# Altium schematic sheet [02] - DCDC_+5V7.SchDoc
size 297 x 209 mm; CompanyName: Wave; SheetNumber: 4; SheetTotal: 5; PRJ_SheetSize: A4
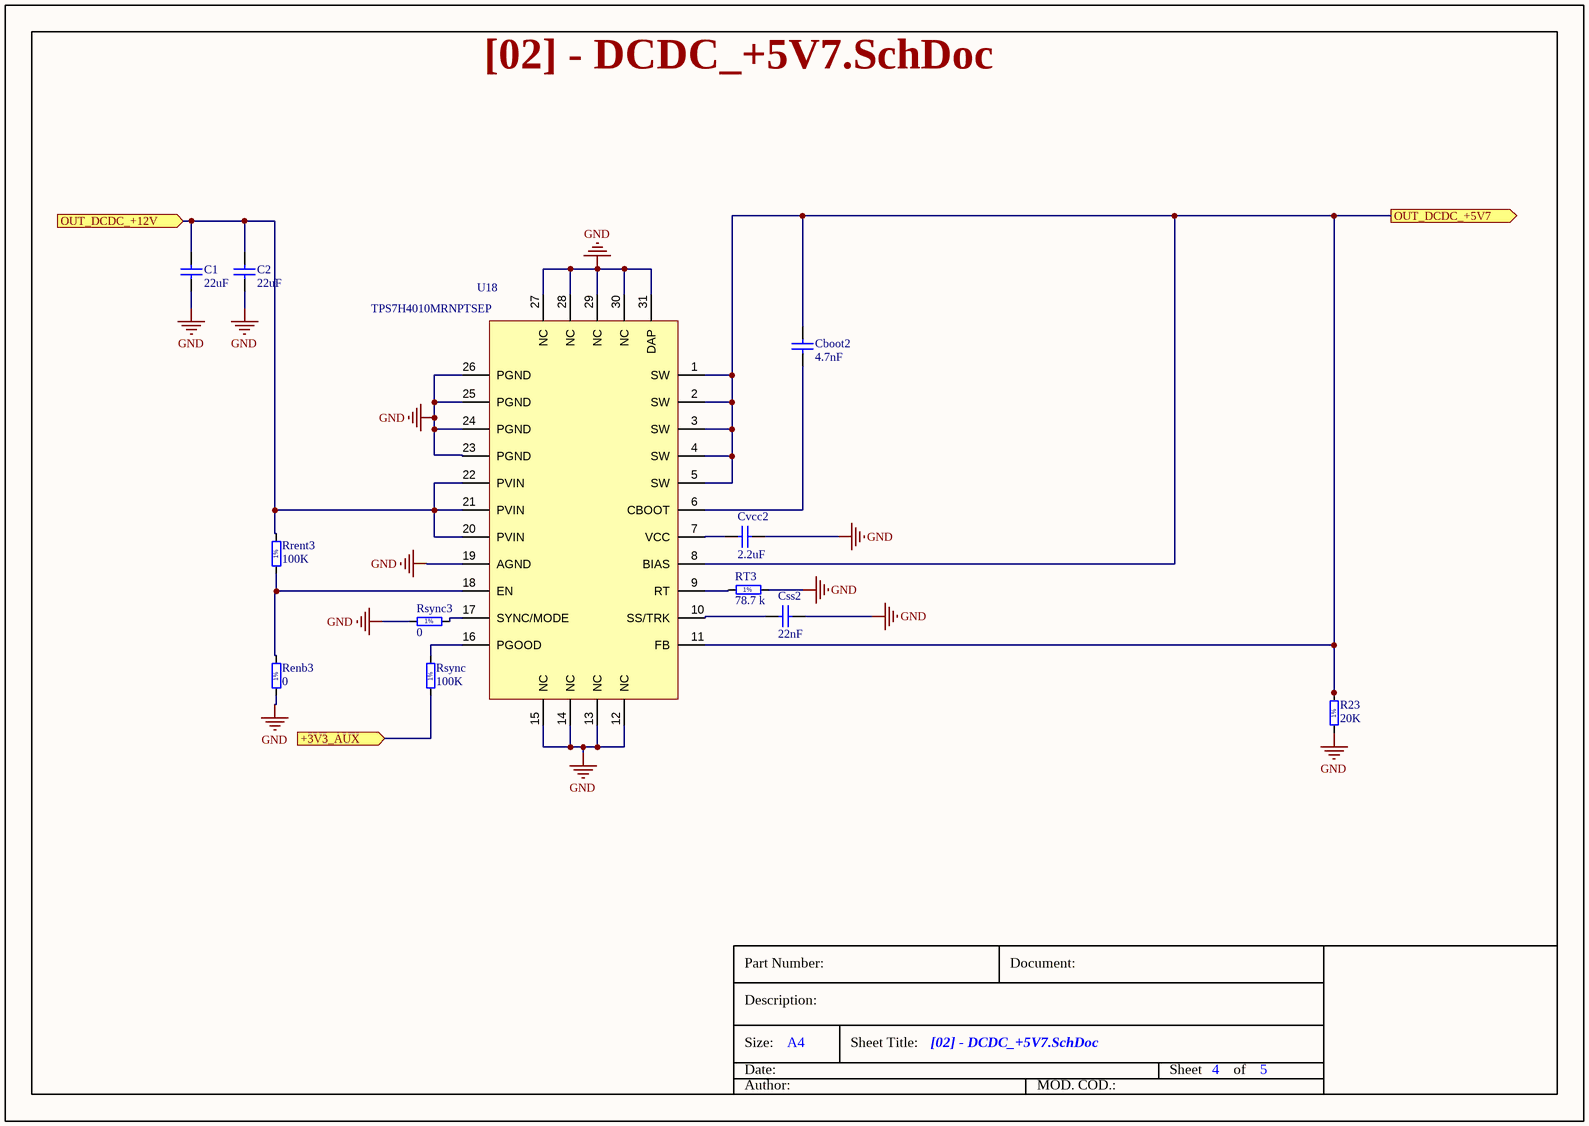
[diagram p0: [02] - DCDC_+5V7.SchDoc]

## Parts
C1  22uF  [CAPC320X160X180L55N]
C2  22uF  [CAPC320X160X180L55N]
Cboot2  4.7nF  [CAPC100X55X55L35N]
Css2  22nF  [CAPC100X55X55L35N]
Cvcc2  2.2uF  [CAPC100X55X55L35N]
R23  20K  [RESC100X50X40L25N]
Renb3  0  [RESC100X50X40L25N]
Rrent3  100K  [RESC100X50X40L25N]
Rsync  100K  [RESC100X50X40L25N]
Rsync3  0  [RESC100X50X40L25N]
RT3  78.7 k  [RESC100X50X40L25N]
U18  TPS7H4010MRNPTSEP  [TPS7H4010MRNPTSEP]

## Ports
+3V3_AUX (in, see [01] - PCU_MODULE[2B], [03] - OUT_+5V7_OCXO_PROTECTION[1C]), OUT_DCDC_+5V7 (out, see [01] - PCU_MODULE[2A], [04] - PSU_+5V_AUX[1A]), OUT_DCDC_+12V (in, see [01] - PCU_MODULE[2A])

## Nets
GND: C1.1 C2.1 Css2.2 Cvcc2.2 R23.1 Renb3.1 Rsync3.1 RT3.2 U18.12(NC) U18.13(NC) U18.14(NC) U18.15(NC) U18.19(AGND) U18.23(PGND) U18.24(PGND) U18.25(PGND) U18.26(PGND) U18.27(NC) U18.28(NC) U18.29(NC) U18.30(NC) U18.31(DAP)
+3V3_AUX: Rsync.1 ; port +3V3_AUX
OUT_DCDC_+5V7: Cboot2.2 R23.2 U18.1(SW) U18.2(SW) U18.3(SW) U18.4(SW) U18.5(SW) U18.8(BIAS) U18.11(FB) ; port OUT_DCDC_+5V7
OUT_DCDC_+12V: C1.2 C2.2 Rrent3.2 U18.20(PVIN) U18.21(PVIN) U18.22(PVIN) ; port OUT_DCDC_+12V
NetCboot2_1: Cboot2.1 U18.6(CBOOT)
NetCss2_1: Css2.1 U18.10(SS/TRK)
NetCvcc2_1: Cvcc2.1 U18.7(VCC)
NetRenb3_2: Renb3.2 Rrent3.1 U18.18(EN)
NetRsync3_2: Rsync3.2 U18.17(SYNC/MODE)
NetRsync_2: Rsync.2 U18.16(PGOOD)
NetRT3_1: RT3.1 U18.9(RT)

## Notes on the sheet
- Part Number:
- Description:
- Document:
- Date:
- Size:
- Sheet Title:
- Sheet
- of
- Author:
- MOD. COD.:
- (in symbol CRCW040220K0FKED) 1%
- (in symbol CRCW040278K7FKED) 1%
- (in symbol CRCW0402100KFKED) 1%

## Library data of the parts
C1 C2 = GRM31CC71E226ME15L: CAP CER 22uF 25V ±20% X7S 1206; Manufacturer: Murata; Material: 4241ConductorMaterial; Dielectric: 1542DielectricType; ComponentLink1URL: https://search.murata.co.jp/Ceramy/image/img/A01X/G101/ENG/GRM31CC71E226ME15-01A.pdf; ComponentLink1Description: Datasheet; Supplier: Digikey; Manufacturer Part Number: GRM31CC71E226ME15L; RoHS: No; Category: Ceramic Capacitors; Stock 1: 3447; Pricing 1: 1=0,92, 10=0,562, 50=0,4202, 100=0,3759, 500=0,30056, 1000=0,27702 (USD); Case/Package: 340Case; Min Operating Temperature: -55°C; Max Operating Temperature: 125°C; Capacitance: 22uF; Tolerance: 20%; Voltage Rating: 25V; Voltage Rating (DC): 25V; Length: 3.2mm; Width: 1.6mm; Height: 1.9mm; Thickness: 1.6mm; Supplier Part Number: 490-GRM31CC71E226ME15LCT-ND
Cboot2 = GRM155R71E472KA01: 0402 4.7 nF 25 V ±10% Tolerance X7R SMT Multilayer Ceramic Capacitor; Manufacturer: Murata; Manufacturer Part Number: GRM155R71E472KA01D; Supplier: Farnell; Supplier Part Number: 4326802; RoHS: Yes; Category: Ceramic Capacitors; Stock: 39799; Pricing: 10=0,015, 100=0,01, 500=0,007, 2500=0,006, 5000=0,0059 (EUR); Pins: 2NUMBER; Material: 4241ConductorMaterial; Lead Free: 5697LeadFree; ComponentLink1URL: https://datasheet.ciiva.com/18184/getdatasheetpartid-129543-18184709.pdf?src-supplier=Verical; ComponentLink1Description: https://datasheet.ciiva.com/18184/getdatasheetpartid-129543-18184709.pdf?src-supplier=Verical; ComponentLink2URL: https://datasheet.ciiva.com/130/product-130032.pdf?src-supplier=Digikey; ComponentLink2Description: https://datasheet.ciiva.com/130/product-130032.pdf?src-supplier=Digikey; ComponentLink3URL: https://datasheet.ciiva.com/16392/product-16392847.pdf?src-supplier=Future+Electronics; ComponentLink3Description: https://datasheet.ciiva.com/16392/product-16392847.pdf?src-supplier=Future+Electronics; ComponentLink4URL: https://datasheet.ciiva.com/2989/product-2989394.pdf?src-supplier=Avnet; ComponentLink4Description: https://datasheet.ciiva.com/2989/product-2989394.pdf?src-supplier=Avnet; ComponentLink5URL: https://datasheet.ciiva.com/2989/product-2989393.pdf?src-supplier=Avnet; ComponentLink5Description: https://datasheet.ciiva.com/2989/product-2989393.pdf?src-supplier=Avnet; ComponentLink6URL: https://datasheet.ciiva.com/130/partnumbering-e-01-130033.pdf?src-supplier=Digikey; ComponentLink6Description: https://datasheet.ciiva.com/130/partnumbering-e-01-130033.pdf?src-supplier=Digikey; ComponentLink7URL: https://datasheet.ciiva.com/130/partnumbering-e-01-130034.pdf?src-supplier=Digikey; ComponentLink7Description: https://datasheet.ciiva.com/130/partnumbering-e-01-130034.pdf?src-supplier=Digikey
Css2 = GRM155R71E223JA61: Multilayer Ceramic Capacitor, 0.022 uF, 25 V, ± 5%, X7R, 0402 [1005 Metric]; Manufacturer: Murata; Manufacturer Part Number: GRM155R71E223JA61D; Supplier: Farnell; Supplier Part Number: 3582812; RoHS: Yes; Category: Ceramic Capacitors; Stock: 11149; Pricing: 10=0,017, 100=0,013, 500=0,012, 2500=0,0118, 5000=0,0115 (EUR); Material: 4241ConductorMaterial; ComponentLink1URL: https://datasheet.ciiva.com/5427/product-5427580.pdf?src-supplier=Mouser; ComponentLink1Description: https://datasheet.ciiva.com/5427/product-5427580.pdf?src-supplier=Mouser; ComponentLink2URL: https://datasheet.ciiva.com/29535/grm155r71e223ka61-01-29535418.pdf?src-supplier=Digikey; ComponentLink2Description: https://datasheet.ciiva.com/29535/grm155r71e223ka61-01-29535418.pdf?src-supplier=Digikey
Cvcc2 = GRM155D71C225ME11: Multilayer Ceramic Capacitor, 2.2 uF, 16 V, ± 20%, X7T, 0402 [1005 Metric]; Manufacturer: Murata; Manufacturer Part Number: GRM155D71C225ME11D; Dielectric: 1545DielectricType; Voltage Rating: 16V; Supplier: Mouser; Supplier Part Number: 81-GRM155D71C225ME11; RoHS: Yes; Category: Ceramic Capacitors; Stock: 102807; Pricing: 1=0,17, 10=0,113, 50=0,113, 100=0,073, 1000=0,067, 10000=0,057 (USD); Case/Package: 343Case; Material: 4241ConductorMaterial; Min Operating Temperature: -55°C; Max Operating Temperature: 125°C; Value: 2.2uF; Tolerance: 20%; Voltage Rating (DC): 16V; Length: 1mm; Width: 500um; Height: 650um; Thickness: 500um; RoHS Compliant: Yes; ComponentLink1URL: https://datasheet.octopart.com/GRM155D71C225ME11D-Murata-datasheet-165579666.pdf?src-supplier=TME; ComponentLink1Description: https://datasheet.octopart.com/GRM155D71C225ME11D-Murata-datasheet-165579666.pdf?src-supplier=TME
R23 = CRCW040220K0FKED: RES 20K OHM 1/16W 1% 0402; Manufacturer: Vishay Dale; Power (Watts): 0,063 W, 1/16 W; Temperature Coefficient: ±100 ppm/ °C; Category: Resistors; Resistance: 20K; Tolerance: ±1%; Footprint Name: RESC1005X40N; ComponentLink1URL: http://www.vishay.com/docs/20035/dcrcwe3.pdf; ComponentLink1Description: Datasheet; Packaging: Cut Tape (CT); Supplier Part Number 1: 541-20.0KLCT-ND; Supplier 1: Digi-Key; Features: AEC Q100 automotive; Operating Temperature: -55 °C ~ 155 °C; Package / Case: 0402 (1005 metrico); Manufacturer Part Number: CRCW040220K0FKED; Part Status: Active; Composition: Thick Film; Manufacturer 1: Vishay Dale; Manufacturer Part Number 1: CRCW040220K0FKED
Renb3 Rsync Rsync3 = CRCW0402100KFKED: RES  100K OHM 1/16W 1% 0402; Manufacturer: Vishay Dale; Power (Watts): 0,063 W, 1/16 W; Temperature Coefficient: ±100 ppm/ °C; Category: Resistors; Resistance: 100K; Tolerance: ±1%; Footprint Name: RESC1005X40N; ComponentLink1URL: http://www.vishay.com/docs/20035/dcrcwe3.pdf; ComponentLink1Description: Datasheet; Packaging: Cut Tape (CT); Supplier Part Number 1: 541-100KLCT-ND; Supplier 1: Digi-Key; Features: AEC Q100 automotive; Operating Temperature: -55 °C ~ 155 °C; Package / Case: 0402 (1005 metrico); Manufacturer Part Number: CRCW0402100KFKED; Part Status: Active; Composition: Thick Film; Manufacturer 1: Vishay Dale; Manufacturer Part Number 1: CRCW0402100KFKED
Rrent3 = CRCW0402100KFKED: RES 100K OHM 1/16W 1% 0402; Manufacturer: Vishay Dale; Power (Watts): 0,063 W, 1/16 W; Temperature Coefficient: ±100 ppm/ °C; Category: Resistors; Resistance: 100K; Tolerance: ±1%; Footprint Name: RESC1005X40N; ComponentLink1URL: http://www.vishay.com/docs/20035/dcrcwe3.pdf; ComponentLink1Description: Datasheet; Packaging: Cut Tape (CT); Supplier Part Number 1: 541-100KLCT-ND; Supplier 1: Digi-Key; Features: AEC Q100 automotive; Operating Temperature: -55 °C ~ 155 °C; Package / Case: 0402 (1005 metrico); Manufacturer Part Number: CRCW0402100KFKED; Part Status: Active; Composition: Thick Film; Manufacturer 1: Vishay Dale; Manufacturer Part Number 1: CRCW0402100KFKED
RT3 = CRCW040278K7FKED: RES 78K7 OHM 1/16W 1% 0402; Manufacturer: Vishay Dale; Power (Watts): 0,063 W, 1/16 W; Temperature Coefficient: ±100 ppm/ °C; Category: Resistors; Resistance: 78K7; Tolerance: ±1%; Footprint Name: RESC1005X40N; ComponentLink1URL: http://www.vishay.com/docs/20035/dcrcwe3.pdf; ComponentLink1Description: Datasheet; Packaging: Cut Tape (CT); Supplier Part Number 1: 541-78.7KLCT-ND; Supplier 1: DigiKey; Features: AEC Q100 automotive; Operating Temperature: -55 °C ~ 155 °C; Package / Case: 0402 (1005 metrico); Manufacturer Part Number: CRCW040278K7FKED; Part Status: Active; Composition: Thick Film; Manufacturer 1: Vishay Dale; Manufacturer Part Number 1: CRCW040278K7FKED
U18 = TPS7H4010MRNPTSEP: Buck Switching Regulator IC Positive Adjustable 1V 1 Output 6A 30-WFQFN Exposed Pad; Manufacturer: Texas Instruments; Supplier: Digikey; Manufacturer Part Number: TPS7H4010MRNPTSEP; RoHS: Yes; Category: Integrated Circuits (ICs); Supplier Part Number: 296-TPS7H4010MRNPTSEP-ND; ComponentLink1Description: Datasheet; ComponentLink1URL: https://www.ti.com/lit/ds/symlink/tps7h4010-sep.pdf?ts=1730267059055&ref_url=https%253A%252F%252Fwww.mouser.ca%252F